# EAGLE design D1_mini_Plus (EAGLE 9.6.0)
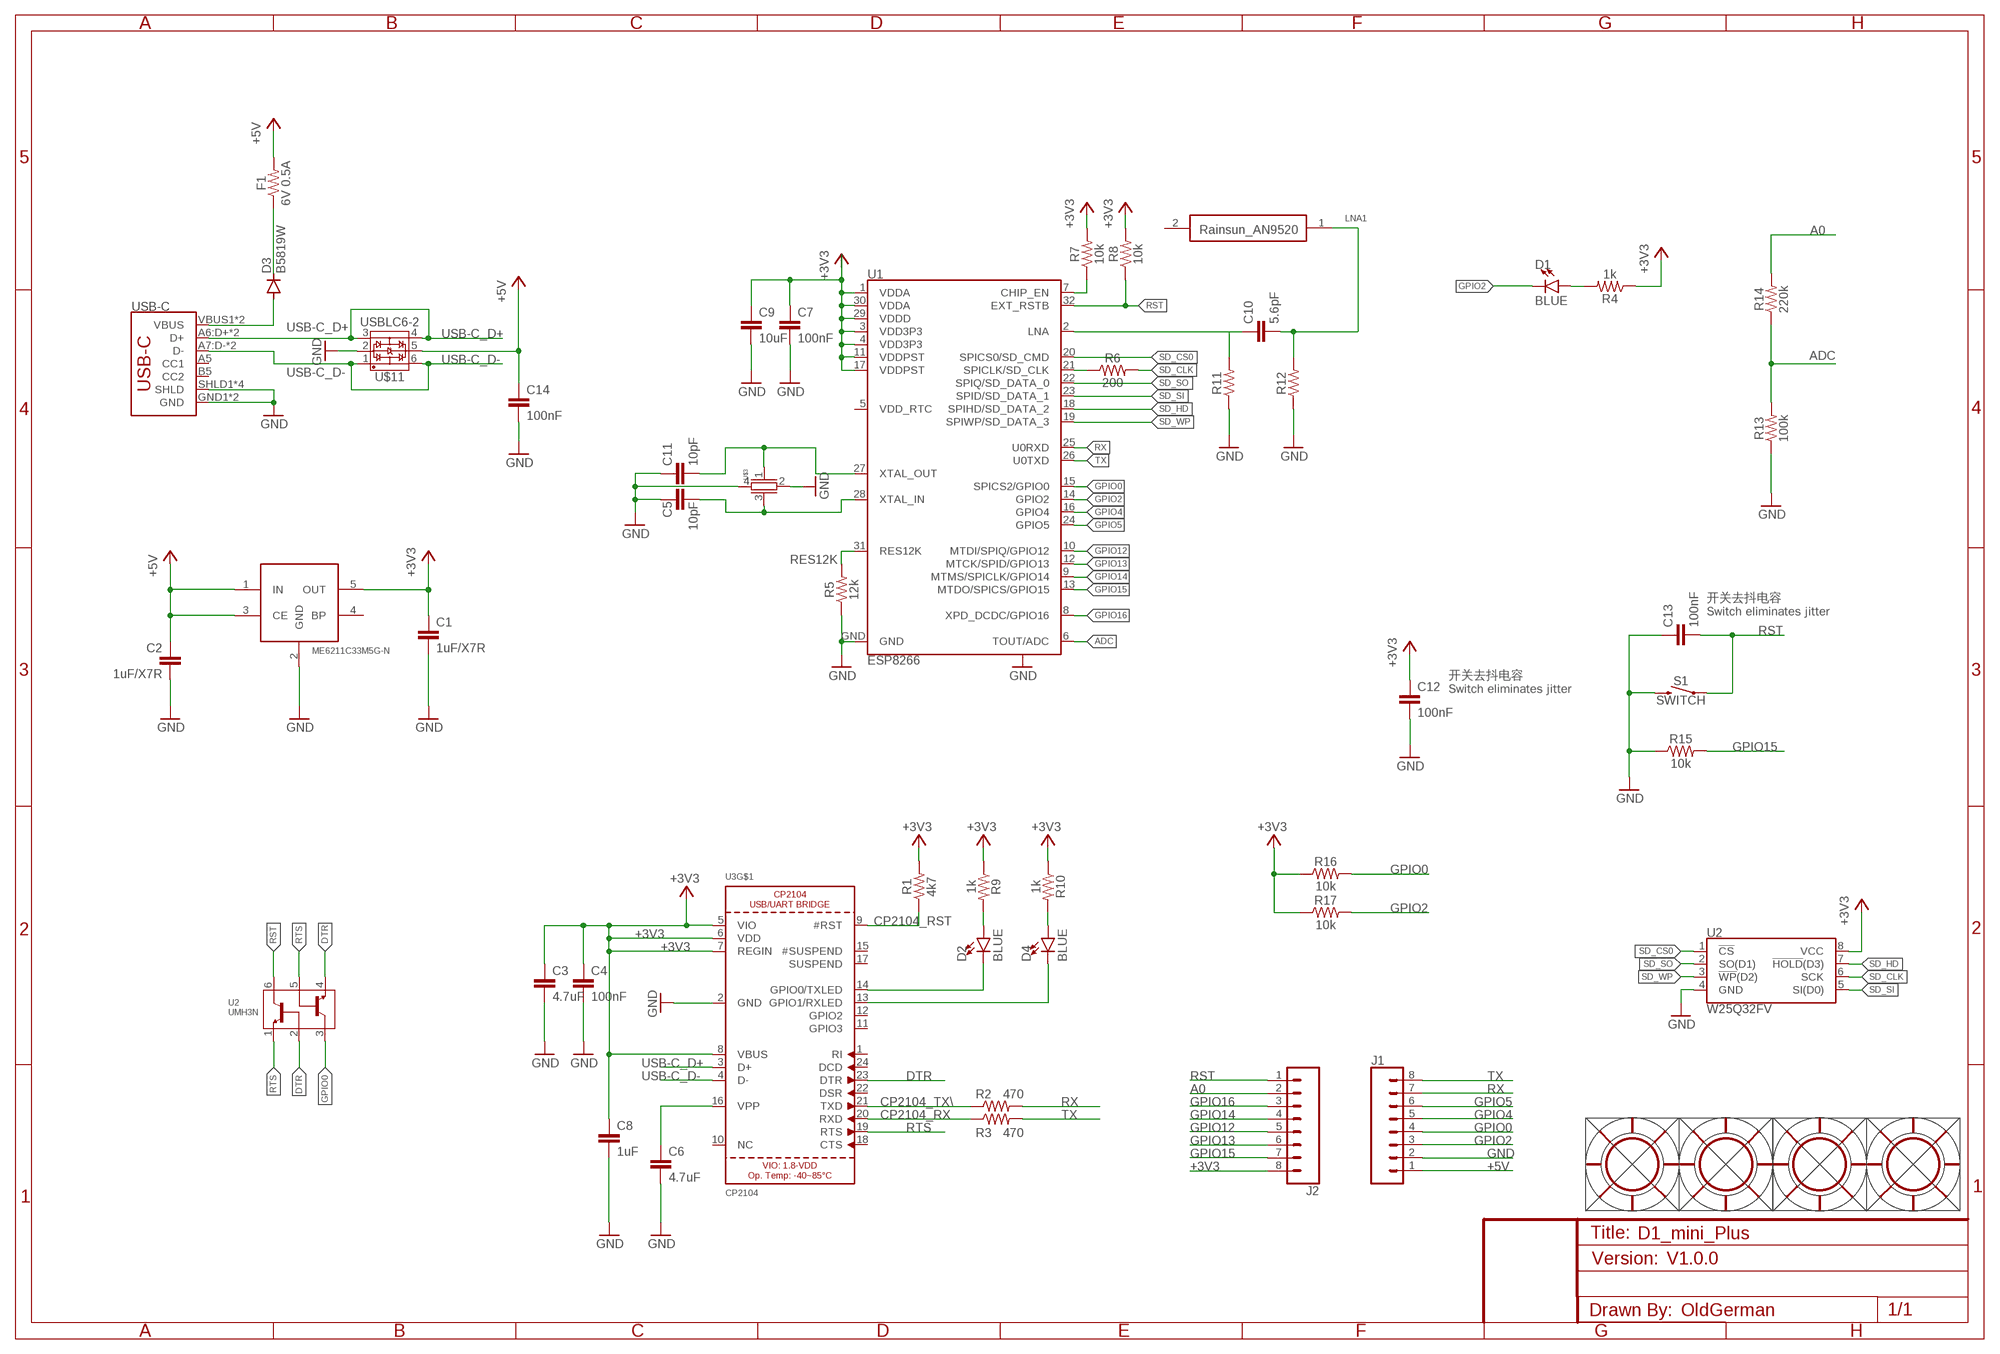
[diagram p0: schematic, sheet 1]

## Parts
C1  1uF/X7R  CAP-0603  [0603]
C2  1uF/X7R  CAP-0603  [0603]
C3  4.7uF  CAP-0603  [0603]
C4  100nF  CAP-0603  [0603]
C5  10pF  CAP-0603  [0603]
C6  4.7uF  CAP-0603  [0603]
C7  100nF  CAP-0603  [0603]
C8  1uF  CAP-0603  [0603]
C9  10uF  CAP-0603  [0603]
C10  5.6pF  CAP-0603  [0603]
C11  10pF  CAP-0603  [0603]
C12  100nF  CAP-0603  [0603]
C13  100nF  CAP-0603  [0603]
C14  100nF  CAP-0603  [0603]
D1  BLUE  LED-BLUE0603  [LED-0603]
D2  BLUE  LED-BLUE0603  [LED-0603]
D3  B5819W  DIODE-SOD323-R  [SOD323-R]
D4  BLUE  LED-BLUE0603  [LED-0603]
F1  6V 0.5A  RESISTOR0603  [0603]
J1  CONN_08NO_SILK_FEMALE_PTH  [1X08_NO_SILK]
J2  CONN_08NO_SILK_FEMALE_PTH  [1X08_NO_SILK]
R1  4k7  RESISTOR0603  [0603]
R2  470  RESISTOR0603  [0603]
R3  470  RESISTOR0603  [0603]
R4  1k  RESISTOR0603  [0603]
R5  12k  RESISTOR0603  [0603]
R6  200  RESISTOR0603  [0603]
R7  10k  RESISTOR0603  [0603]
R8  10k  RESISTOR0603  [0603]
R9  1k  RESISTOR0603  [0603]
R10  1k  RESISTOR0603  [0603]
R11  RESISTOR0603  [0603]
R12  RESISTOR0603  [0603]
R13  100k  RESISTOR0603  [0603]
R14  220k  RESISTOR0603  [0603]
R15  10k  RESISTOR0603  [0603]
R16  10k  RESISTOR0603  [0603]
R17  10k  RESISTOR0603  [0603]
S1  SWITCH  MOMENTARY-SWITCH-SPST-SMD-RIGHT-ANGLE  [TACTILE_SWITCH_SMD_RIGHT_ANGLE]
U1  ESP8266  [QFN32-5X5MM]
U2  W25Q32FV  W25Q32FVSS  [SOIC-8]
U3  CP2104  [QFN24_4MM_SMSC]
U$1  ME6211C33M5G-N  [SOT23-5]
U$2  U2  UMH3N_DUAL_CRYSTAL  [SOT363]
U$3  3225_CRYSTALL  [3.2X2.5_KX-7]
U$4  RAINSUN_AT9520  [AN9520]
U$7  SUN-HOLE_2.1  [SUN-HOLE_2.1MM]
U$8  SUN-HOLE_2.1  [SUN-HOLE_2.1MM]
U$9  SUN-HOLE_2.1  [SUN-HOLE_2.1MM]
U$10  SUN-HOLE_2.1  [SUN-HOLE_2.1MM]
U$11  USBLC6-2  USBLC6-2SOT23-6  [SOT23-6]
USB-C  USB-C_BELOW_BOARD  [USB-C_BLOW_BOARD]

## Nets
+3V3: C1.1 C3.1 C4.1 C7.1 C8.1 C9.1 C12.1 J2.8 R1.2 R4.1 R7.2 R8.2 R9.1 R10.1 R16.1 R17.1 U1.1(VDDA) U1.3(VDD3P3) U1.4(VDD3P3) U1.11(VDDPST) U1.17(VDDPST) U1.29(VDDD) U1.30(VDDA) U2.8(VCC) U3.5(VIO) U3.6(VDD) U3.7(REGIN) U3.8(VBUS) U$1.5(OUT)
+5V: C2.1 C14.1 F1.2 J1.1 U$1.1(IN) U$1.3(CE) U$11.5
A0: J2.2 R14.2
ADC: R13.2 R14.1 U1.6(TOUT/ADC)
CP2104_RST: R1.1 U3.9(#RST)
CP2104_RX: R3.1 U3.20(RXD)
CP2104_TX\: R2.1 U3.21(TXD)
DTR: U3.23(DTR) U$2.2 U$2.4
GND: C1.2 C2.2 C3.2 C4.2 C5.1 C6.2 C7.2 C8.2 C9.2 C11.1 C12.2 C13.1 C14.2 J1.2 R5.1 R11.1 R12.1 R13.1 R15.1 S1.2 U1.GND U2.4(GND) U3.2(GND) U$1.2(GND) U$3.2 U$3.4 U$11.2 USB-C.GND1(GND) USB-C.GND2(GND) USB-C.SHLD1(SHLD) USB-C.SHLD2(SHLD) USB-C.SHLD3(SHLD) USB-C.SHLD4(SHLD)
GPIO0: J1.4 R16.2 U1.15(SPICS2/GPIO0) U$2.3
GPIO2: D1.C J1.3 R17.2 U1.14(GPIO2)
GPIO3: D4.C U3.13(GPIO1/RXLED)
GPIO4: J1.5 U1.16(GPIO4)
GPIO5: J1.6 U1.24(GPIO5)
GPIO12: J2.5 U1.10(MTDI/SPIQ/GPIO12)
GPIO13: J2.6 U1.12(MTCK/SPID/GPIO13)
GPIO14: J2.4 U1.9(MTMS/SPICLK/GPIO14)
GPIO15: J2.7 R15.2 U1.13(MTDO/SPICS/GPIO15)
GPIO16: J2.3 U1.8(XPD_DCDC/GPIO16)
LNA: C10.1 R11.2 U1.2(LNA)
LNA1: C10.2 R12.2 U$4.1
N$1: D1.A R4.2
N$2: C6.1 U3.16(VPP)
N$3: D2.A R9.2
N$4: C5.2 U1.28(XTAL_IN) U$3.3
N$5: C11.2 U1.27(XTAL_OUT) U$3.1
N$6: R7.1 U1.7(CHIP_EN)
N$7: D3.C F1.1
N$8: D4.A R10.2
N$9: D3.A USB-C.VBUS1(VBUS) USB-C.VBUS2(VBUS)
N$10: D2.C U3.14(GPIO0/TXLED)
N$20: R6.1 U1.21(SPICLK/SD_CLK)
RES12K: R5.2 U1.31(RES12K)
RST: C13.2 J2.1 R8.1 S1.1 U1.32(EXT_RSTB) U$2.6
RTS: U3.19(RTS) U$2.1 U$2.5
RX: J1.7 R2.2 U1.25(U0RXD)
SD_CLK: R6.2 U2.6(SCK)
SD_CS0: U1.20(SPICS0/SD_CMD) U2.1(!CS!)
SD_HD: U1.18(SPIHD/SD_DATA_2) U2.7(!HOLD!(D3))
SD_SI: U1.23(SPID/SD_DATA_1) U2.5(SI(D0))
SD_SO: U1.22(SPIQ/SD_DATA_0) U2.2(SO(D1))
SD_WP: U1.19(SPIWP/SD_DATA_3) U2.3(!WP!(D2))
TX: J1.8 R3.2 U1.26(U0TXD)
USB-C_D+: U3.3(D+) U$11.3 U$11.4 USB-C.A6:D+(D+) USB-C.B6:D+(D+)
USB-C_D-: U3.4(D-) U$11.1 U$11.6 USB-C.A7:D-(D-) USB-C.B7:D-(D-)
Unconnected: U1.5(VDD_RTC) U3.1(RI) U3.10(NC) U3.11(GPIO3) U3.12(GPIO2) U3.15(#SUSPEND) U3.17(SUSPEND) U3.18(CTS) U3.22(DSR) U3.24(DCD) U$1.4(BP) U$4.2 USB-C.A5(CC1) USB-C.B5(CC2)

## Notes on the sheet
- 开关去抖电容
  Switch eliminates jitter
- 开关去抖电容
  Switch eliminates jitter
- V1.0.0
- OldGerman

## Power pins joined to a net without a drawn wire
TP: U3.THERM(TP)

## Library data of the parts
C1-C14 = SparkFun-Capacitors:CAP
D1 D2 D4 = SparkFun-LED:LED-BLUE: Blue SMD LED Used in manufacturing of various products at SparkFun Packages: 0603 - SMD 0603 package [Product Link] <http://www.digikey.com/product-detail/en/SMLE12BC7TT86/511-1589-2-ND/1641808> 1206 - SMD1206 package [Product Link] <http://www.digikey.com/product-detail/en/lite-on-inc/LTST-C150TBKT/160-1643-1-ND/573584> SparkFun Products: ESP8266 Thing-Dev Board <https://www.sparkfun.com/products/13711> RedBoard <https://www.sparkfun.com/products/12757>; PROD_ID: DIO-08575
D3 = diode:DIODE-: DIODE
F1 R1-R17 = SparkFun-Resistors:RESISTOR: Generic Resistor Package
J1 J2 = SparkFun-Connectors:CONN_08: Multi connection point. Often used as Generic Header-pin footprint for 0.1 inch spaced/style header connections On any of the 0.1 inch spaced packages, you can populate with these: Break Away Headers - Straight <https://www.sparkfun.com/products/116> (PRT-00116) Break Away Male Headers - Right Angle <https://www.sparkfun.com/products/553> (PRT-00553) Female Headers <https://www.sparkfun.com/products/115> (PRT-00115) Break Away Headers - Machine Pin <https://www.sparkfun.com/products/117> (PRT-00117) Break Away Female Headers - Swiss Machine Pin <https://www.sparkfun.com/products/743> (PRT-00743) Arduino Stackable Header - 8 Pin <https://www.sparkfun.com/products/9279> (PRT-09279) For SCREWTERMINALS and SPRING TERMINALS visit here: Screw Terimnals on SparkFun.com <https://www.sparkfun.com/search/results?term=Screw+Terminals> (5mm/3.5mm/2.54mm spacing) This device is also useful as a general connection point to wire up your design to another part of your project. Our various solder wires solder well into these plated through hole pads. Hook-Up Wire - Assortment (Stranded, 22 AWG) <https://www.sparkfun.com/products/11375> (PRT-11375) Hook-Up Wire - Assortment (Solid Core, 22 AWG) <https://www.sparkfun.com/products/11367> (PRT-11367) View the entire wire category on our website here <https://www.sparkfun.com/categories/141> Special notes: Molex polarized connector foot print use with SKU : PRT-08231 with associated crimp pins and housings. 1MM SMD Version SKU: PRT-10208 NOTES ON THE VARIANTS LOCK and LOCK_LONGPADS... This footprint was designed to help hold the alignment of a through-hole component (i.e. 6-pin header) while soldering it into place. You may notice that each hole has been shifted either up or down by 0.005 of an inch from it's more standard position (which is a perfectly straight line). This slight alteration caused the pins (the squares in the middle) to touch the edges of the holes. Because they are alternating, it causes a "brace" to hold the component in place. 0.005 has proven to be the perfect amount of "off-center" position when using our standard breakaway headers. Although looks a little odd when you look at the bare footprint, once you have a header in there, the alteration is very hard to notice. Also,if you push a header all the way into place, it is covered up entirely on the bottom side.; PROD_ID: CONN-08438
S1 = SparkFun-Switches:MOMENTARY-SWITCH-SPST: Momentary Switch (Pushbutton) - SPST Normally-open (NO) SPST momentary switches (buttons, pushbuttons). Variants PTH-12MM - 12mm square, through-hole Momentary Pushbutton Switch - 12mm Square <https://www.sparkfun.com/products/9190> (COM-09190) PTH-6.0MM, PTH-6.0MM-KIT - 6.0mm square, through-hole Mini Pushbutton Switch <https://www.sparkfun.com/products/97> (COM-00097) KIT package intended for soldering kit's - only one side of pads' copper is exposed. PTH-RIGHT-ANGLE-KIT - Right-angle, through-hole Right Angle Tactile Button <https://www.sparkfun.com/products/10791> - Used on SparkFun BigTime Watch Kit <https://www.sparkfun.com/products/11734> SMD-12MM - 12mm square, surface-mount Tactile Button - SMD (12mm) <https://www.sparkfun.com/products/12993> (COM-12993) Used on SparkFun PicoBoard <https://www.sparkfun.com/products/11888> SMD-4.5MM - 4.5mm Square Trackball Switch Used on SparkFun Blackberry Trackballer Breakout <https://www.sparkfun.com/products/13169> SMD-4.6MMX2.8MM - 4.60mm x 2.80mm, surface mount Used on SparkFun SAMD21 Mini Breakout <https://www.sparkfun.com/products/13664> SMD-5.2MM, SMD-5.2-REDUNDANT - 5.2mm square, surface-mount Mini Pushbutton Switch - SMD <https://www.sparkfun.com/products/8720> (COM-08720) Used on Arduino Pro Mini <https://www.sparkfun.com/products/11114> REDUNDANT package connects both switch circuits together SMD-6.0X3.5MM - 6.0 x 3.5mm, surface mount Momentary Reset Switch SMD <https://www.sparkfun.com/products/8229> (COM-08229) SMD-6.2MM-TALL - 6.2mm square, surface mount Tactile Button - SMD (6mm) <https://www.sparkfun.com/products/12992> Used on SparkFun Digital Sandbox <https://www.sparkfun.com/products/12651> SMD-RIGHT-ANGLE - Right-angle, surface mount Used on SparkFun Block for Intel® Edison - Arduino <https://www.sparkfun.com/products/13036>; PROD_ID: COMP-12265
U1 = SparkFun-RF:ESP8266: Espressif ESP8266 WiFi/Microcontroller SoC The ESP8266 WiFi Module is a self contained SOC with integrated TCP/IP protocol stack that can give any microcontroller access to your WiFi network. The ESP8266 is capable of either hosting an application or offloading all Wi-Fi networking functions from another application processor. SparkFun Products WiFi Module ESP8266 <https://www.sparkfun.com/products/13678> (WRL-13678) SparkFun ESP8266 Thing <https://www.sparkfun.com/products/13231> (WRL-13231) SparkFun WiFi Shield - ESP8266 <https://www.sparkfun.com/products/13287> (WRL-13287) SparkFun ESP8266 Thing - Dev Board <https://www.sparkfun.com/products/13711> (WRL-13711) SparkFun Blynk Board - ESP8266 <https://www.sparkfun.com/products/13794> (WRL-13794); PROD_ID: IC-12452
U2 = SparkFun-IC-Memory:W25Q32FV: W25Q32FV 32Mb (4MB) Serial Flash Memory The W25Q32FV support the standard Serial Peripheral Interface (SPI), Dual/Quad I/O SPI as well as 2-clocks instruction cycle Quad Peripheral Interface (QPI). 104MHz, SPI, 8-SOIC-EIAJ Datasheet <http://www.winbond.com/resource-files/w25q32fv%20revh%20091613.pdf> SparkFun Products SparkFun Blynk Board - ESP8266 <https://www.sparkfun.com/products/13794> (WRL-13794); PROD_ID: IC-13229
U3 = microbuilder:CP2104: CP2104 - USB to UART Bridge VDD Output: 3.45V; SPICEPREFIX: X
U$1 = SparkFun-IC-Power:ME6211C33M5G-N: ME621133M5G-N SOT23-5 3.3V 500mA 低差压线性稳压器
U$2 = microbuilder:UMH3N_DUAL_CRYSTAL: sot363 NPN 100mA 50V Complex Digital Transistors (Bias Resistor Built-in Transistors) https://www.mouser.com/datasheet/2/348/umh3ntn-e-1018108.pdf
U$3 = crystal-geyer_V1_0:3225_CRYSTALL
U$4 = LAN:RAINSUN_AT9520
U$7-U$10 = sun-hole:SUN-HOLE_2.1
U$11 = ESD-protection:USBLC6-2
USB-C = SparkFun-Connectors:USB-C_BELOW_BOARD

## Board
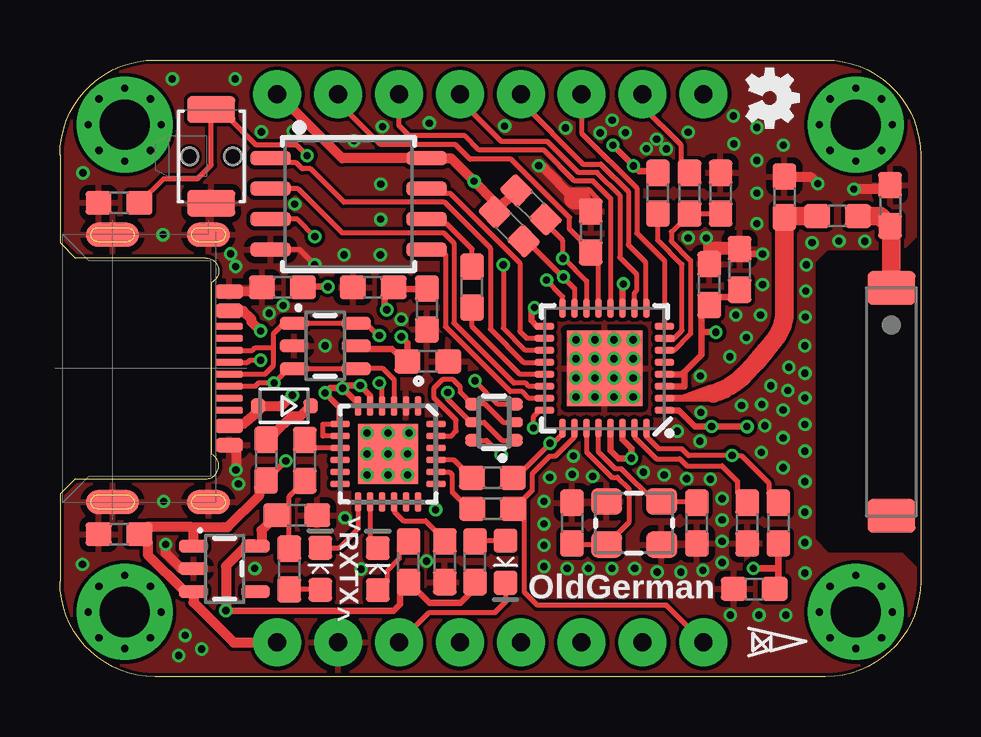
[diagram p1: board, top side]
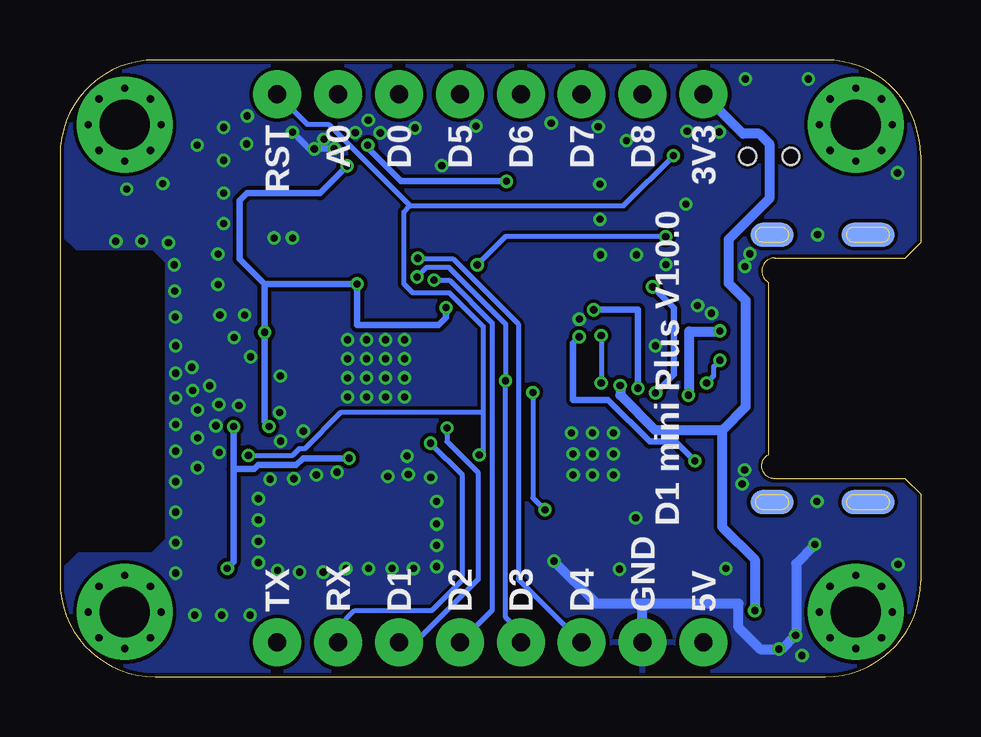
[diagram p2: board, bottom side, seen from below]

Size 35.88 x 25.72 mm. Coordinates in mm from the lower left corner, seen from the top.
Outline: 0,21.75 arc-90 3.97,25.72 31.91,25.72 arc-90 35.88,21.75 35.88,3.97 arc-90 31.91,0 3.97,0 arc-90 0,3.97 0,7.62 0.63,8.25 6.08,8.25 arc153 6.32,9.28 6.32,16.44 arc153 6.08,17.46 0.63,17.46 0,18.1 0,21.75
Copper layers (1*16): Top 0.035mm / dielectric 0.9mm / Bottom 0.035mm
Design rules "jiepei 1mm extreme cheap *": minimum track width 8mil, minimum drill 0.3mm, track to track 6mil, track to pad 6mil, pad to pad 6mil, via to via 6mil, smd to smd 6mil, copper to edge 6mil, drill to drill 6mil, minimum pad ring 5mil, minimum via ring 5mil, stop-mask expansion 1.5mil, vias tented up to drill 15mil, thermal gap 10mil

### Footprints (pad centres in the part's own frame; a part is rotated, then mirrored left to right if it is on the bottom)
0603 = smd 1.1 x 1: 1 -0.85,0; 2 0.85,0
LED-0603 = smd 1 x 1: A -0.877,0; C 0.877,0
SOD323-R = smd 0.6 x 0.6: A 1.1,0; C -1.1,0
1X08_NO_SILK = drill 0.75 pad 2: 1 0,0; 2 2.54,0; 3 5.08,0; 4 7.62,0; 5 10.16,0; 6 12.7,0; 7 15.24,0; 8 17.78,0
TACTILE_SWITCH_SMD_RIGHT_ANGLE = smd 1.1 x 2: 1 -1.95,0; 2 1.95,0 | hole 0.7: 0,0.9; 0,-0.9
QFN32-5X5MM = smd 0.8 x 0.285: 1 -2.5,1.75; 2 -2.5,1.25; 3 -2.5,0.75; 4 -2.5,0.25; 5 -2.5,-0.25; 6 -2.5,-0.75; 7 -2.5,-1.25; 8 -2.5,-1.75; 17 2.5,-1.75; 18 2.5,-1.25; 19 2.5,-0.75; 20 2.5,-0.25; 21 2.5,0.25; 22 2.5,0.75; 23 2.5,1.25; 24 2.5,1.75 | smd 0.285 x 0.8: 9 -1.75,-2.5; 10 -1.25,-2.5; 11 -0.75,-2.5; 12 -0.25,-2.5; 13 0.25,-2.5; 14 0.75,-2.5; 15 1.25,-2.5; 16 1.75,-2.5; 25 1.75,2.5; 26 1.25,2.5; 27 0.75,2.5; 28 0.25,2.5; 29 -0.25,2.5; 30 -0.75,2.5; 31 -1.25,2.5; 32 -1.75,2.5 | smd 3.15 x 3.15: GND 0,0
SOIC-8 = smd 0.61 x 1.702: 1 -1.905,-3.251; 2 -0.635,-3.251; 3 0.635,-3.251; 4 1.905,-3.251; 5 1.905,3.251; 6 0.635,3.251; 7 -0.635,3.251; 8 -1.905,3.251
QFN24_4MM_SMSC = smd 0.8 x 0.28: 1 -2,1.25; 2 -2,0.75; 3 -2,0.25; 4 -2,-0.25; 5 -2,-0.75; 6 -2,-1.25; 13 2,-1.25; 14 2,-0.75; 15 2,-0.25; 16 2,0.25; 17 2,0.75; 18 2,1.25 | smd 0.28 x 0.8: 7 -1.25,-2; 8 -0.75,-2; 9 -0.25,-2; 10 0.25,-2; 11 0.75,-2; 12 1.25,-2; 19 1.25,2; 20 0.75,2; 21 0.25,2; 22 -0.25,2; 23 -0.75,2; 24 -1.25,2 | smd 2.5 x 2.5: THERM 0,0
SOT23-5 = smd 0.55 x 1.2: 1 -0.95,-1.3; 2 0,-1.3; 3 0.95,-1.3; 4 0.95,1.3; 5 -0.95,1.3
SOT363 = smd 0.5 x 0.584: 1 -0.75,-0.9; 3 0.75,-0.9; 4 0.75,0.9; 6 -0.75,0.9 | smd 0.4 x 0.584: 2 0,-0.9; 5 0,0.9
3.2X2.5_KX-7 = smd 1.3 x 1.1: 1 -1.15,-0.9; 2 1.15,-0.9; 3 1.15,0.9; 4 -1.15,0.9
AN9520 = smd 1.4 x 2: 1 -4.75,0; 2 4.75,0
SUN-HOLE_2.1MM = drill 2.1 pad 4: P$1 0,0 | drill 0.3: P$2 0,1.525; P$3 0,-1.525; P$4 1.525,0; P$5 -1.525,0; P$6 -1.075,1.075; P$7 -1.075,-1.075; P$8 1.075,-1.075; P$9 1.075,1.075
SOT23-6 = smd 0.55 x 1.2: 1 0.95,1.3; 2 0,1.3; 3 -0.95,1.3; 4 -0.95,-1.3; 5 0,-1.3; 6 0.95,-1.3
USB-C_BLOW_BOARD = smd 0.3 x 1.15: A5 -1.25,0.865; A6:D+ -0.25,0.865; A7:D- 0.25,0.865; A8 1.25,0.865; B5 1.75,0.865; B6:D+ 0.75,0.865; B7:D- -0.75,0.865; B8 -1.75,0.865 | smd 0.6 x 1.15: GND1 -3.2,0.865; GND2 3.2,0.865; VBUS1 -2.4,0.865; VBUS2 2.4,0.865 | smd 1 x 1.8: SHLD1 -5.575,0; SHLD4 5.575,0 | smd 1 x 2.2: SHLD2 -5.575,-4; SHLD3 5.575,-4 | smd 1 x 1.8 bottom: SHLD5 -5.575,0; SHLD7 5.575,0 | smd 1 x 2.2 bottom: SHLD6 -5.575,-4; SHLD8 5.575,-4

### Placement (x,y rotation side)
C1  9.87,6.74 0 top
C2  2.46,5.95 180 top
C3  15.3,15.33 270 top
C4  13.06,16.24 180 top
C5  26.55,6.41 90 top
C6  16.04,4.79 270 top
C7  27.07,16.35 90 top
C8  9.28,16.24 180 top
C9  28.33,16.99 90 top
C10  32.41,19.21 0 top
C11  21.34,6.41 270 top
C12  28.94,3.66 180 top
C13  2.46,19.76 0 top
C14  15.34,13.15 0 top
D1  18.57,4.8 270 top
D2  13.25,4.49 90 top
D3  9.35,11.3 180 top
D4  10.85,4.5 90 top
F1  8.59,9.04 270 top
J1  9.05,1.43 0 top
J2  26.83,24.29 180 top
R1  10.21,9.02 270 top
R2  18.03,8.3 0 top
R3  18.04,7 0 top
R4  17.3,4.79 90 top
R5  28.65,6.41 90 top
R6  17.18,16.25 90 top
R7  24.92,20.16 90 top
R8  29.95,6.41 270 top
R9  14.54,4.79 90 top
R10  9.56,4.49 270 top
R11  30.19,20 270 top
R12  34.61,19.65 270 top
R13  27.54,20.16 270 top
R14  26.24,20.16 90 top
R15  22.13,18.54 270 top
R16  18.73,18.77 315 top
R17  19.63,19.68 315 top
S1  6.31,21.7 270 top
U1  22.7,12.86 180 top
U2  12.03,19.71 270 top
U3  13.68,9.29 270 top
U$1  6.86,4.5 270 top
U$2  18.1,10.61 90 top
U$3  23.93,6.41 0 top
U$4  34.66,11.46 270 top
U$5  [OSHW-LOGO-MINI]  29.6,24.13 270 top
U$7  2.7,23.02 0 top
U$8  2.7,2.7 0 top
U$9  33.18,2.7 0 top
U$10  33.18,23.02 0 top
U$11  11.06,13.8 90 top
USB-C  6.19,12.86 270 top

### Tracks (layer width: path | path; a pad name or v marks a point on that pad's centre or on a via)
+3V3  (via drill 0.3 pad 0.51)
  Top 0.203: C1.1 9.07,6.74 9.3,6.97 9.53,6.74 | R10.1 9.53,5.36 9.53,6.74 | R1.2 9.53,7.49 9.53,6.74 | U3.8 10.97,10.04 10.97,10.54 U3.7
  Top 0.279: 12.55,12.12 12.93,11.74 U3.5 | 12.55,12.12 | 12.55,12.12 v12.52,12.14 11.89,12.14 v11.78,12.03 | U3.5 | U1.17 19.88,14.61 19.65,14.84 19.65,15.25 v19.78,15.39 | U1.11 23.45,16.34 v23.49,16.38 | 26.75,14.37 26.75,15.5 C7.1 27.4,15.84 28.03,15.84 C9.1 | 26.75,14.37 26.75,13.41 26.03,12.7 | U1.30 23.45,9.89 23.82,9.51 v23.82,9.11 23.27,9.11 22.95,9.43 U1.29 | 26.03,12.7 25.94,12.61 U1.4 | U1.3 26.03,12.11 26.03,12.7 | R7.2 24.92,21.08 24.13,21.08 v23.91,21.3 v23.91,21.31 v23.05,22.16 | v27.34,14.37 26.75,14.37 | R17.1 18.84,20.28 | U1.1 25.8,11.11 26.47,10.43 v27.16,10.43 v28.64,10.43 | v6.91,2.76 v6.91,2.75 13.91,2.75 14.18,3.02 14.18,3.59 R9.1 15.4,3.08 16.69,3.08 17.3,3.69 R4.1 | 29.81,3.68 C12.1 29.95,3.82 29.95,4.48 | 29.87,5.48 R8.2 29.95,4.48 | v28.9,4.52 29.91,4.52 29.95,4.48 | 12.43,11.42 U3.6 12.43,11.39 v11.78,12.03 | C3.1 arc-90 15.28,16.16 13.91,16.16 C4.1 13.54,15.87 13.54,15.39 v13.63,15.3 | U3.7 11.66,10.54 11.66,11.23 v11.05,11.84 | v11.05,11.84 | v11.17,16.26 v11.16,16.26 10.11,16.26 10.11,16.25 C8.1 | v11.78,12.03 11.25,12.03 v11.05,11.84
  Top 0.406: J2.8 9.1,24.29 11.76,21.62 U2.8 16.31,21.62 v17.27,20.66 18.12,19.8 R16.1 R17.1 | v6.91,2.76 v6.92,2.77 6.92,4.62 7.83,5.53 8.09,5.53 U$1.5 8.41,5.45 8.41,6.11 C1.1
  Bottom 0.279: 27.34,16.38 v27.34,14.37 27.34,10.64 27.16,10.46 v27.16,10.43 | v23.91,21.3 25.04,20.16 28.07,20.16 28.39,19.85 28.39,17.42 27.35,16.38 27.34,16.38 | v23.05,22.16 23.05,22.06 21.66,20.67 17.28,20.67 v17.27,20.66 | 27.34,16.38 23.77,16.38 v23.49,16.38 23.49,14.66 20.11,14.66 19.78,14.98 v19.78,15.39 | v23.82,9.11 v23.83,9.11 25.75,9.11 26.02,8.83 27.61,8.83 27.79,8.66 28.64,8.66 v28.64,10.43 28.64,4.78 v28.9,4.52 | v13.63,15.3 11.78,15.3 v11.78,12.04 v11.78,12.03 | v11.17,16.26 10.29,15.38 10.29,12.6 v11.05,11.84
  Bottom 0.406: 8.28,10.3 8.28,6.25 6.91,4.89 v6.91,2.76 | J2.8 7.4,22.64 6.72,22.64 6.31,22.23 6.31,19.93 8.01,18.24 8.01,16.41 7.3,15.7 7.3,11.25 8.25,10.3 8.28,10.3 | 8.28,10.3 11.08,10.3 12.52,11.74 v12.52,12.14
+5V  (via drill 0.3 pad 0.51)
  Top 0.279: U$11.5 12.69,13.8 12.83,13.66 13.85,13.66 14.36,13.15 C14.1 14.49,13.92 v14.23,14.18 | v9.41,9 9.4,9 F1.2
  Top 0.406: J1.1 7.23,1.43 5.56,3.09 U$1.3 5.2,3.55 3.67,5.09 3.67,5.59 C2.1 3.61,6.24 5.48,6.24 5.56,6.16 U$1.1 5.56,6.24 7,6.24 8.3,7.54 8.3,7.89 F1.2
  Bottom 0.279: v9.41,9 10.22,9.8 11.29,9.8 13.04,11.55 14.49,11.55 14.49,13.92 v14.23,14.18
A0
  Top 0.203: J2.2 24.29,23.78 25.88,22.19 25.88,21.38 R14.2
ADC
  Top 0.203: U1.6 25.61,13.61 26.29,14.29 26.29,17.36 25.48,18.17 25.48,18.55 R14.1 R13.2
CP2104_RST
  Top 0.203: U3.9 10.54,9.54 R1.1
CP2104_RX
  Top 0.203: U3.20 16.24,8.54 16.35,8.43 16.35,7.71 17.06,7 R3.1
CP2104_TX\
  Top 0.203: R2.1 16.44,9.04 U3.21
DTR
  Top 0.203: U3.23 16.31,10.04 16.52,10.24 16.52,10.7 15.6,11.61 15.6,12.05 15.94,12.39 16.38,12.39 16.69,12.08 16.69,11.86 U$2.4 17.73,11.37 18.48,10.61 U$2.2
GND  (via drill 0.3 pad 0.51)
  Top 0.203: C4.2 12.17,16.18 | R13.1 27.17,21.39 | R11.1 30,21.04 | R12.1 34.45,20.34 | v10.62,17.18 10,17.81 U2.4 | U1.GND v23.1,13.26 | 20.25,21.31 v19.96,21.31 | v19.96,21.31 20.95,20.31 22.02,20.31 22.52,19.82 21.45,19.82 v19.96,21.31
  Top 0.279: v29.29,17.62 28.55,17.62 C9.2 | C9.2 28.17,18 27.23,18 26.95,17.71 26.95,17.32 C7.2 | C9.2 28.23,17.73 26.96,17.73 v26.96,18.29 v26.95,18.3
  Top 0.406: C2.2 1.49,5.83 | U$1.2 5.55,4.51 5.05,4.51 4.41,5.16 v4.4,5.52 | R12.1 34.44,20.33 v33.1,20.33 | R11.1 31.3,20.85 v31.59,20.56 | USB-C.GND2 7.34,9.38 v7.34,8.62 | R15.1 22.13,19.49 21.7,19.92 | 21.45,19.92 20.13,21.24 20.02,21.24 v19.96,21.31 | C8.2 8.25,16.06 USB-C.GND1
  Top 0.864: 21.7,19.92 21.45,19.92
  Bottom 0.279: v26.18,22.71 25.43,21.96 25.28,21.96 v25.28,22.01 24.48,22.01
  Bottom 0.406: v0.94,4.68 1.03,4.68 | v4.4,5.51 v4.4,5.52 4.4,5.5 5.19,4.72 5.19,1.75 v5.21,1.72 5.79,1.15 v5.91,1.15 6.68,1.15 7.59,2.06 7.59,3.05 11.59,3.05 | v15.28,4.82 13.52,3.05 11.59,3.05 | J1.2 11.59,3.05
  other vias: 29.29,16.35 29.05,18.89 29.05,20.16 29.05,21.53 29.05,22.9 30.16,22.17 28.62,14.14 27.93,13.34 26.69,12.54 31.35,18.1 31.11,17.18 31.1,16.08 31.05,13.8 31.06,12.66 29.64,12.13 28.42,11.31 32.47,18.17 33.55,18.15 26.72,11.01 29.21,15.08 22.21,8.36 25.19,8.41 24.32,8.53 31.06,4.32 31.06,5.59 31.06,6.86 31.06,8.13 31.06,9.4 31.06,10.52 21.51,14.05 22.3,14.05 23.1,14.05 23.89,12.46 23.1,12.46 23.89,13.26 21.51,12.46 23.89,11.67 12.8,10.16 12.8,9.29 13.68,10.16 14.55,10.16 30.35,11.94 29.24,9.35 30.26,2.57 27.95,2.57 29.14,2.57 31.06,11.63 21.36,8.44 20.42,8.31 27.6,4.76 20.17,5.48 28.07,23.39 28.1,22.22 13.37,19.08 13.37,20.54 9.79,19.71 12.26,22.35 15.4,23.09 18.54,22.96 13.44,22.93 21.08,22.88 25.73,10.24 26.68,9.83 11.85,17.59 28.18,15.08 13.35,17.59 0.96,21.01 31.07,15 22.52,22.68 23.02,23.21 4.3,18.43 4.32,7.31 4.95,0.88 4.68,24.92 7.3,24.92 23.89,14.05 21.51,13.26 22.3,13.26 21.51,11.67 22.3,11.67 23.1,11.67 13.68,9.29 14.49,9.29 13.68,8.42 12.8,8.42 14.49,8.42 22.3,12.46 20.17,6.37 8.39,22.72 11.88,6.62 7.44,8.04 9.73,22.75 12.55,4.49 24.87,22.42 23.57,22.69 26.13,8.26 27.12,8.24 30.38,12.91 30.14,11.13 30.14,9.96 30.14,8.72 29.38,10.46 29.25,11.35 27.6,5.65 27.6,6.54 27.6,7.43 20.17,7.31 20.17,4.59 21.14,4.51 22.04,4.51 24.9,4.36 25.89,4.36 26.8,4.44 21.41,9.2 8.72,15.15 9.3,15.48 8.12,4.51 26.19,18.3 24.44,22.02 7.32,17.11 7.11,17.64 23.95,4.51 23.01,4.51 14.23,14.91 11.06,13.8
  pour Top: 6.35,17.62 0.79,17.62 0.16,18.26 0.16,21.67 arc-90 4.05,25.56 31.83,25.56 arc-90 35.72,21.67 35.72,18.41 35.16,17.86 31.99,17.86 31.43,17.3 31.43,12.72 31.43,12.72 31.43,5.72 32.04,5.11 35.11,5.11 35.95,4.27 35.95,3.89 arc-90 32.21,0.16 3.97,0.16 arc-90 0.16,3.97 0.16,7.46 0.79,8.1 6.35,8.1
  pour Bottom: 6.35,17.62 0.79,17.62 0.16,18.26 0.16,21.67 arc-90 4.05,25.56 31.83,25.56 arc-90 35.72,21.67 35.72,18.44 35.16,17.88 31.96,17.88 31.41,17.33 31.41,12.8 31.4,12.8 31.4,5.7 32.01,5.09 35.08,5.09 35.95,4.22 35.95,3.94 arc-90 32.11,0.11 4.02,0.11 arc-90 0.16,3.97 0.16,7.46 0.79,8.1 6.35,8.1
GPIO0  (via drill 0.3 pad 0.51)
  Top 0.203: U1.15 21.46,16.19 20.99,16.65 v20.99,16.67 20.97,16.67 19.47,18.17 R16.2 | U$2.3 18.27,11.36 v17.3,12.33 v17.3,12.34
  Bottom 0.203: v20.99,16.67 21.04,16.62 21.04,16.61 20.58,17.07 19.67,17.07 17.3,14.71 v17.3,12.34 17.3,2.48 16.67,1.84 J1.4
GPIO2  (via drill 0.3 pad 0.51)
  Top 0.203: U1.14 21.95,16.5 21.02,17.43 21,17.45 v20.96,17.45 20.96,18.18 20.23,18.91 R17.2 | D1.C 18.57,3.12 18.14,2.68 15.39,2.68 J1.3
  Bottom 0.203: v20.96,17.45 20.95,17.44 19.5,17.44 16.76,14.7 16.76,4.06 J1.3
GPIO3
  Top 0.203: D4.C 11.63,5.38 12.43,6.18 U3.13
GPIO4  (via drill 0.3 pad 0.51)
  Top 0.203: U1.16 20.95,15.86 v20.28,16.54 v20.29,16.54
  Bottom 0.203: J1.5 17.86,2.78 17.86,14.76 19.64,16.54 v20.29,16.54
GPIO5  (via drill 0.3 pad 0.51)
  Top 0.203: v19.74,10.37 19.74,10.85 20,11.11 U1.24
  Bottom 0.203: J1.6 21.07,1.43 18.44,4.06 18.44,8.51 19.74,9.81 v19.74,10.37
GPIO12
  Top 0.203: U1.10 23.95,16.02 24.05,16.11 24.05,16.77 23.34,17.48 23.34,20.07 22.39,21.02 21.6,21.02 20.31,22.31 18.4,22.31 16.67,24.05 J2.5
GPIO13
  Top 0.203: U1.12 22.95,19.94 22.22,20.67 21.46,20.67 20.17,21.96 17.48,21.96 16.88,22.55 14.56,22.55 14.13,22.98 J2.6
GPIO14
  Top 0.203: J2.4 19.21,23.97 21.8,21.38 22.53,21.38 23.69,20.22 23.69,18 24.41,17.28 24.41,15.4 U1.9
GPIO15
  Top 0.203: U1.13 22.45,17.5 22.26,17.69 R15.2 22.13,17.77 21.24,18.66 21.24,19.15 18.81,21.58 17.1,21.58 16.49,22.19 13.36,22.19 11.59,23.97 J2.7
GPIO16
  Top 0.203: U1.8 25.2,17.34 24.05,18.49 24.05,20.37 21.75,22.67 J2.3
LNA
  Top 0.203: 27.16,11.61 26.94,11.82 26.66,11.64 | 25.91,11.61 U1.2 25.23,11.58 27.25,11.54
  Top 0.254: 27.1,12.04 25.91,11.61 U1.2
  Top 0.287: 27.23,11.82 27.23,11.61 27.16,11.61 U1.2
  Top 0.762: C10.1 30.25,19.21 R11.2 30.19,15.18 arc-37 29.84,14.13 arc-7 28.53,12.6 arc-29 27.23,11.82
LNA1
  Top 0.762: U$4.1 34.66,18.74 R12.2 34.19,19.21 C10.2
N$1
  Top 0.203: D1.A 17.33,5.67 R4.2
N$2
  Top 0.203: U3.16 13.93,6.9 14.32,6.51 15.24,6.51 16.04,5.71 C6.1
N$3
  Top 0.203: D2.A 13.65,4.01 13.65,4.42 14.14,4.92 14.14,5.25 R9.2
N$4
  Top 0.203: U1.28 22.45,9.37 23.15,8.67 23.41,8.67 24.78,7.31 U$3.3 26.5,7.31 C5.2
N$5
  Top 0.203: C11.2 21.39,5.51 U$3.1 23.71,6.43 23.71,7.85 23.24,8.32 23,8.32 21.95,9.37 U1.27
N$6
  Top 0.203: U1.7 25.26,14.05 25.55,14.05 25.93,14.44 25.93,17.19 24.92,18.2 R7.1
N$7
  Top 0.406: F1.1 8.59,10.14 8.94,10.14 9.65,10.85 10.01,10.85 D3.C
N$8
  Top 0.203: D4.A 10.84,3.64 R10.2
N$9  (via drill 0.3 pad 0.51)
  Top 0.406: USB-C.VBUS2 7.15,10.55 7.67,10.55 8.25,11.04 D3.A 9.24,11.3 v9.68,11.74 | USB-C.VBUS1 7.64,15.26 7.99,14.91 7.99,14.8 v8.36,14.42
  Bottom 0.406: v9.68,11.74 9.66,11.77 9.66,14.39 8.39,14.39 v8.36,14.42
N$10
  Top 0.203: U3.14 12.93,5.69 D2.C
N$20
  Top 0.203: U1.21 19.18,12.61 17.18,14.61 R6.1
RES12K
  Top 0.203: U1.31 23.95,10 24.87,9.08 25.84,9.08 26.13,8.79 27.6,8.79 28.24,8.15 28.24,7.66 R5.2
RST  (via drill 0.3 pad 0.51)
  Top 0.203: U$2.6 17.78,9.86 v18.39,9.25 v18.4,9.25 | C13.2 4.31,20.76 5.74,20.76 6.31,21.34 S1.1 6.69,23.65 8.15,22.19 9.84,22.19 v10.31,21.73 | R8.1 29.54,7.66 29.54,8.09 28.4,9.23 v28.02,9.23 26.2,9.23 25.91,9.52 24.94,9.52 24.44,10.01 24.44,10.35 U1.32
  Bottom 0.203: v10.31,21.73 v10.31,21.72 12.38,19.64 21.27,19.64 21.28,19.64 | J2.1 25.58,23.04 24.68,23.04 21.28,19.64 | 18.24,11.03 18.24,14.61 19.63,16 21.16,16 21.54,16.38 21.54,19.38 21.28,19.64 | 18.24,11.03 18.24,9.41 v18.4,9.25 | 18.24,11.03 24.15,11.03 25.68,9.5 25.91,9.5 26.19,9.23 v28.02,9.23
RTS  (via drill 0.3 pad 0.51)
  Top 0.203: U3.19 15.66,8.02 v15.66,6.96 | v16.16,11.86 16.16,11.57 17.13,10.61 U$2.5 17.68,10.61 18.43,9.86 U$2.1
  Bottom 0.203: v16.16,11.86 v16.16,11.85 16.16,7.46 v15.66,6.96
RX  (via drill 0.3 pad 0.51)
  Top 0.203: R2.2 19.01,8.3 19.01,8.32 v20.43,9.73 20.55,9.73 20.95,10.13 U1.25
  Bottom 0.203: v20.43,9.73 19.1,8.41 19.1,4.04 20.37,2.77 23.59,2.77 24.29,2.06 J1.7
SD_CLK
  Top 0.203: R6.2 17.18,17.83 16.13,18.87 15.48,18.87 U2.6
SD_CS0
  Top 0.203: U2.1 8.97,21.43 9.85,21.43 10.1,21.18 10.45,21.18 11.84,19.78 16.03,19.78 17.94,17.87 17.94,14.5 19.33,13.11 U1.20
SD_HD
  Top 0.203: U1.18 19.47,14.11 19.17,14.4 19.17,17.24 16.27,20.14 15.48,20.14 U2.7
SD_SI
  Top 0.203: U1.23 19.56,11.61 19.28,11.89 18.77,11.89 16.06,14.6 16.06,17.62 15.88,17.81 U2.5
SD_SO
  Top 0.203: U1.22 19.56,12.11 19.42,12.25 18.92,12.25 16.42,14.74 16.42,18.08 15.98,18.52 11.75,18.52 9.92,20.35 U2.2
SD_WP  (via drill 0.3 pad 0.51)
  Top 0.203: U1.19 19.41,13.61 18.49,14.53 18.49,17.18 v18.48,17.18 | v10.62,18.35 9.9,19.08 U2.3
  Bottom 0.203: v18.48,17.18 17.29,18.37 10.64,18.37 v10.62,18.35
TX
  Top 0.203: J1.8 25.27,2.99 19.89,2.99 19.35,3.53 19.35,7.4 18.95,7 R3.2 18.91,7 19.69,7.78 19.69,8.47 20.42,9.2 20.65,9.2 21.45,10.01 U1.26
USB-C_D+  (via drill 0.3 pad 0.51)
  Top 0.203: USB-C.A6:D+ 7.83,13.11 7.91,13.19 v8.36,13.19 | USB-C.B6:D+ 8.15,12.11 8.29,12.25 v8.92,12.25 v8.93,12.25 9.53,12.85 U$11.3 U$11.4 13.46,12.85 13.93,12.38 U3.3
  Bottom 0.203: v8.92,12.25 8.64,12.53 8.64,12.92 v8.36,13.19
USB-C_D-  (via drill 0.3 pad 0.51)
  Top 0.203: USB-C.A7:D- 8.53,12.61 8.9,12.98 8.9,13.72 | 8.9,13.72 8.9,14.3 9.35,14.75 U$11.1 U$11.6 12.74,14.75 13.26,14.23 v13.31,14.23 | 8.9,13.72 8.14,13.72 8.03,13.61 USB-C.B7:D- | v13.31,12.25 v13.31,12.24 13.43,12.13 U3.4
  Bottom 0.203: v13.31,14.23 v13.31,12.25

### Text on the board
tPlace: ^ | RX | TX | OldGerman | ^
bPlace: 3V3 | D8 | D7 | D6 | D5 | D0 | A0 | RST | D1 mini Plus V1.0.0 | 5V | GND | D4 | D3 | D2 | D1 | RX | TX
tDocu: ^ | SYS
CartoonLogobmp: JLCJLCJLCJLC